# Altium schematic sheet Nexie rev.2.SchDoc
size 297 x 209 mm; ESKD_Naimenovanie_Izdeliya: {Наименование изделия}; ESKD_OboznachenieDokumenta: {ХХХХ.ХХХХХХ.ХХХ ЭХ}
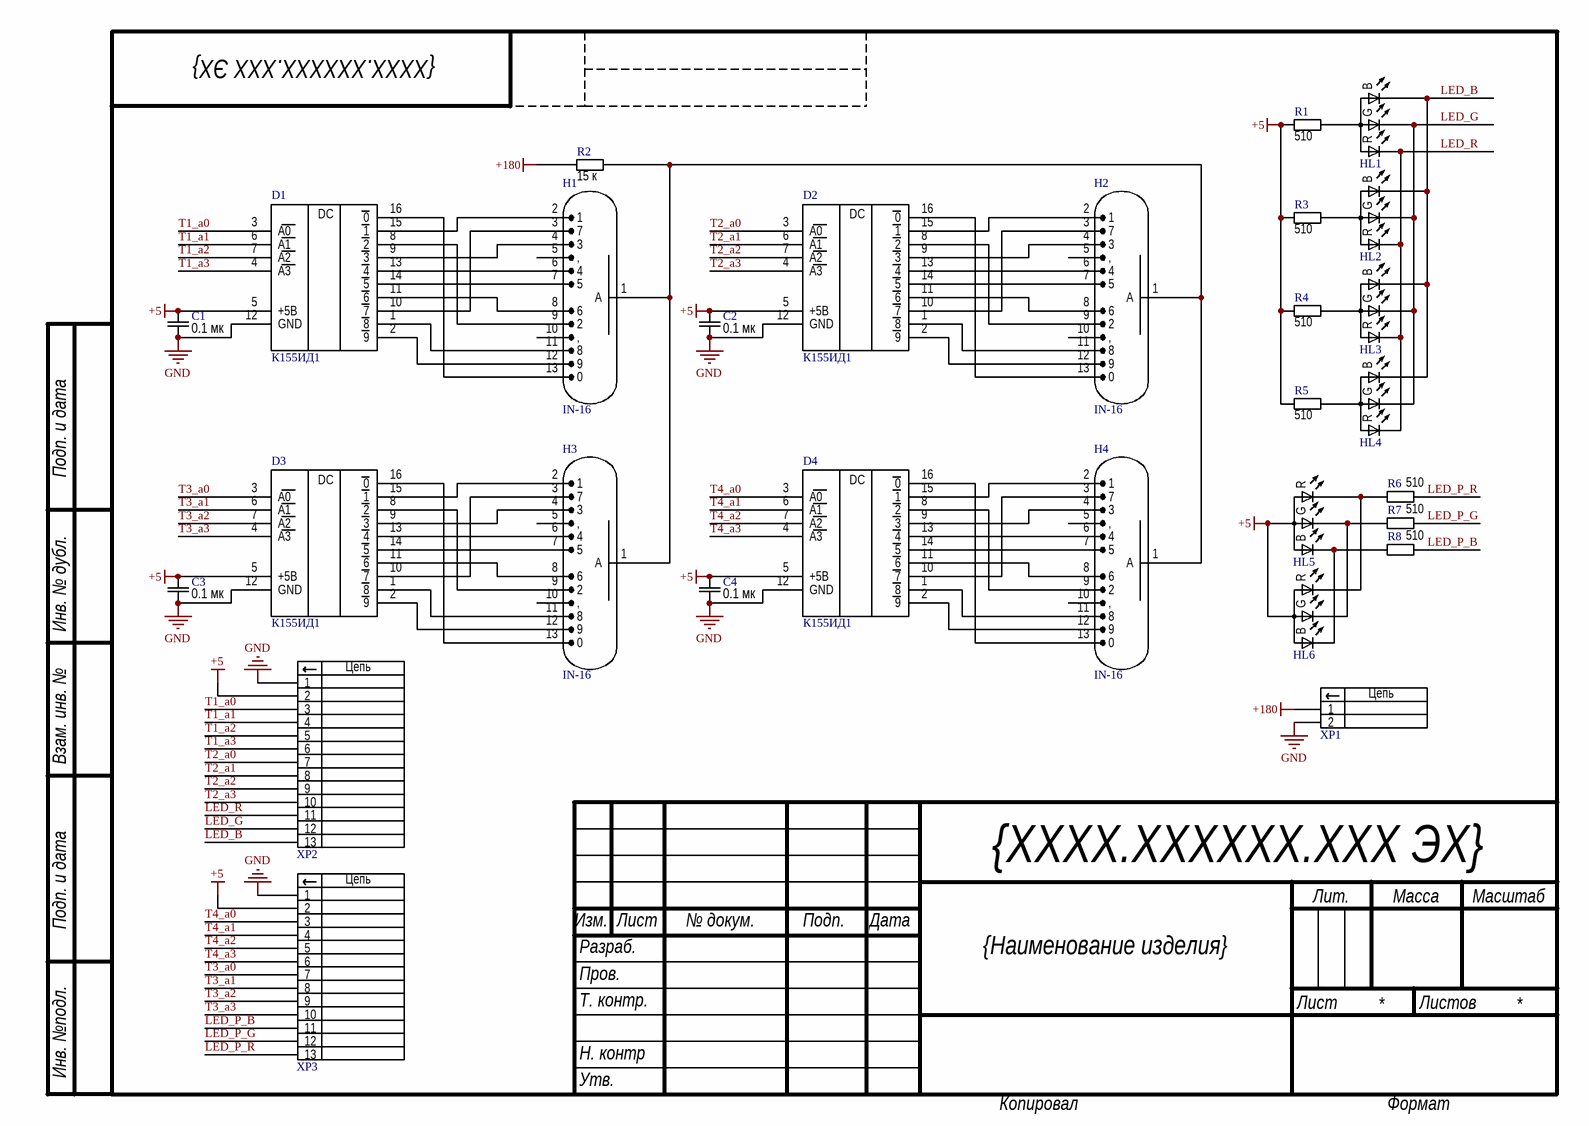
[diagram p0: Nexie rev.2.SchDoc]

## Parts
C1  value 0.1 мк  [SMD_0603]  (hidden comment: Capacitors)
C2  value 0.1 мк  [SMD_0603]  (hidden comment: Capacitors)
C3  value 0.1 мк  [SMD_0603]  (hidden comment: Capacitors)
C4  value 0.1 мк  [SMD_0603]  (hidden comment: Capacitors)
D1  К155ИД1  [К155ИД1]
D2  К155ИД1  [К155ИД1]
D3  К155ИД1  [К155ИД1]
D4  К155ИД1  [К155ИД1]
H1  IN-16  [IN_16_tube]
H2  IN-16  [IN_16_tube]
H3  IN-16  [IN_16_tube]
H4  IN-16  [IN_16_tube]
HL1  TO-3228BC-MRPBFGF  [TO-3228BC-MRPBFGF]  (value not drawn)
HL2  TO-3228BC-MRPBFGF  [TO-3228BC-MRPBFGF]  (value not drawn)
HL3  TO-3228BC-MRPBFGF  [TO-3228BC-MRPBFGF]  (value not drawn)
HL4  TO-3228BC-MRPBFGF  [TO-3228BC-MRPBFGF]  (value not drawn)
HL5  BL-L515RGBC  [BL-L515RGBC]  (value not drawn)
HL6  BL-L515RGBC  [BL-L515RGBC]  (value not drawn)
R1  value 510  [SMD_0402]  (hidden comment: Resistor)
R2  value 15 к  [SMD_2512]  (hidden comment: Resistor)
R3  value 510  [SMD_0402]  (hidden comment: Resistor)
R4  value 510  [SMD_0402]  (hidden comment: Resistor)
R5  value 510  [SMD_0402]  (hidden comment: Resistor)
R6  value 510  [SMD_0402]  (hidden comment: Resistor)
R7  value 510  [SMD_0402]  (hidden comment: Resistor)
R8  value 510  [SMD_0402]  (hidden comment: Resistor)
XP1  DS1021-1*2SF11  [DS1021-1*2]  (value not drawn)
XP2  DS1021-1*13SF11  [DS1021-1*13]  (value not drawn)
XP3  DS1021-1*13SF11  [DS1021-1*13]  (value not drawn)

## Nets
+5: C1.2 C2.2 C3.2 C4.2 D1.5(+5В) D2.5(+5В) D3.5(+5В) D4.5(+5В) HL5.3(A) HL6.3(A) R1.1 R3.1 R4.1 R5.1 XP2.2 XP3.2
+180: R2.1 XP1.1
GND: C1.1 C2.1 C3.1 C4.1 D1.12(GND) D2.12(GND) D3.12(GND) D4.12(GND) XP1.2 XP2.1 XP3.1
LED_B: HL1.3(R) HL2.3(R) HL3.3(R) HL4.3(R) XP2.13
LED_G: HL1.2(G) HL2.2(G) HL3.2(G) HL4.2(G) XP2.12
LED_P_B: R8.2 XP3.11
LED_P_G: R7.2 XP3.12
LED_P_R: R6.2 XP3.13
LED_R: HL1.1(R) HL2.1(R) HL3.1(R) HL4.1(R) XP2.11
T1_a0: D1.3(А0) XP2.3
T1_a1: D1.6(А1) XP2.4
T1_a2: D1.7(А2) XP2.5
T1_a3: D1.4(А3) XP2.6
T2_a0: D2.3(А0) XP2.7
T2_a1: D2.6(А1) XP2.8
T2_a2: D2.7(А2) XP2.9
T2_a3: D2.4(А3) XP2.10
T3_a0: D3.3(А0) XP3.7
T3_a1: D3.6(А1) XP3.8
T3_a2: D3.7(А2) XP3.9
T3_a3: D3.4(А3) XP3.10
T4_a0: D4.3(А0) XP3.3
T4_a1: D4.6(А1) XP3.4
T4_a2: D4.7(А2) XP3.5
T4_a3: D4.4(А3) XP3.6
NetD1_1: D1.1(8) H1.11(8)
NetD1_2: D1.2(9) H1.12(9)
NetD1_8: D1.8(2) H1.9(2)
NetD1_9: D1.9(3) H1.4(3)
NetD1_10: D1.10(7) H1.3(7)
NetD1_11: D1.11(6) H1.8(6)
NetD1_13: D1.13(4) H1.6(4)
NetD1_14: D1.14(5) H1.7(5)
NetD1_15: D1.15(1) H1.2(1)
NetD1_16: D1.16(0) H1.13(0)
NetD2_1: D2.1(8) H2.11(8)
NetD2_2: D2.2(9) H2.12(9)
NetD2_8: D2.8(2) H2.9(2)
NetD2_9: D2.9(3) H2.4(3)
NetD2_10: D2.10(7) H2.3(7)
NetD2_11: D2.11(6) H2.8(6)
NetD2_13: D2.13(4) H2.6(4)
NetD2_14: D2.14(5) H2.7(5)
NetD2_15: D2.15(1) H2.2(1)
NetD2_16: D2.16(0) H2.13(0)
NetD3_1: D3.1(8) H3.11(8)
NetD3_2: D3.2(9) H3.12(9)
NetD3_8: D3.8(2) H3.9(2)
NetD3_9: D3.9(3) H3.4(3)
NetD3_10: D3.10(7) H3.3(7)
NetD3_11: D3.11(6) H3.8(6)
NetD3_13: D3.13(4) H3.6(4)
NetD3_14: D3.14(5) H3.7(5)
NetD3_15: D3.15(1) H3.2(1)
NetD3_16: D3.16(0) H3.13(0)
NetD4_1: D4.1(8) H4.11(8)
NetD4_2: D4.2(9) H4.12(9)
NetD4_8: D4.8(2) H4.9(2)
NetD4_9: D4.9(3) H4.4(3)
NetD4_10: D4.10(7) H4.3(7)
NetD4_11: D4.11(6) H4.8(6)
NetD4_13: D4.13(4) H4.6(4)
NetD4_14: D4.14(5) H4.7(5)
NetD4_15: D4.15(1) H4.2(1)
NetD4_16: D4.16(0) H4.13(0)
NetH1_1: H1.1(A) H2.1(A) H3.1(A) H4.1(A) R2.2
NetHL1_4: HL1.4(A) R1.2
NetHL2_4: HL2.4(A) R3.2
NetHL3_4: HL3.4(A) R4.2
NetHL4_4: HL4.4(A) R5.2
NetHL5_1: HL5.1(B) HL6.1(B) R8.1
NetHL5_2: HL5.2(G) HL6.2(G) R7.1
NetHL5_4: HL5.4(R) HL6.4(R) R6.1

Not connected (* = marked no-connect by the designer): H1 5(,) 10(,); H2 5(,) 10(,); H3 5(,) 10(,); H4 5(,) 10(,)

## Notes on the sheet
- Подп. и дата
- Инв. № дубл.
- Взам. инв. №
- Изм.
- Лист
- № докум.
- Подп.
- Дата
- Лит.
- Масса
- Масштаб
- Разраб.
- Пров.
- Т. контр.
- Листов
- Инв. №подл.
- Н. контр
- Утв.
- Копировал
- Формат
- (in symbol DS1021-1*2SF11) Цепь
- (in symbol DS1021-1*13SF11) Цепь
- (in symbol TO-3228BC-MRPBFGF) B
- (in symbol К155ИД1) DC

## Library data of the parts
H1-H4 = IN-16: Manufacturer: СССР; ESKD: ИН-16
HL1-HL4 = TO-3228BC-MRPBFGF: Manufacturer: Taiwan Oasis Technology Co., Ltd; Class: LED; ESKD: TO-3228BC-MRPBFGF; Creator: FedorenkoS
HL5 HL6 = BL-L515RGBC: Manufacturer: Betlux; Class: LED; ESKD: BL-L515RGBC; Creator: FedorenkoS
XP1 = DS1021-1*2SF11: Производитель: Connfly; Разработчик библиотеки: Федоренко С.С.; System: Connector; ЕСКД: DS1021-1*2SF11
XP2 XP3 = DS1021-1*13SF11: PLS; Производитель: Connfly; Разработчик библиотеки: Федоренко С.С.; System: Connector; ЕСКД: DS1021-1*13SF11
C1-C4 = Capacitors: ESKD: *; Manufacturer: *; Creator: PavelR
R1-R8 = Resistor: Manufacturer: *; ESKD: *; Creator: PavelR